# EAGLE design wrist (EAGLE 9.6.2)
COMPANY: ADAFRUIT INDUSTRIES; DRAWN: KTOWN; REV: F
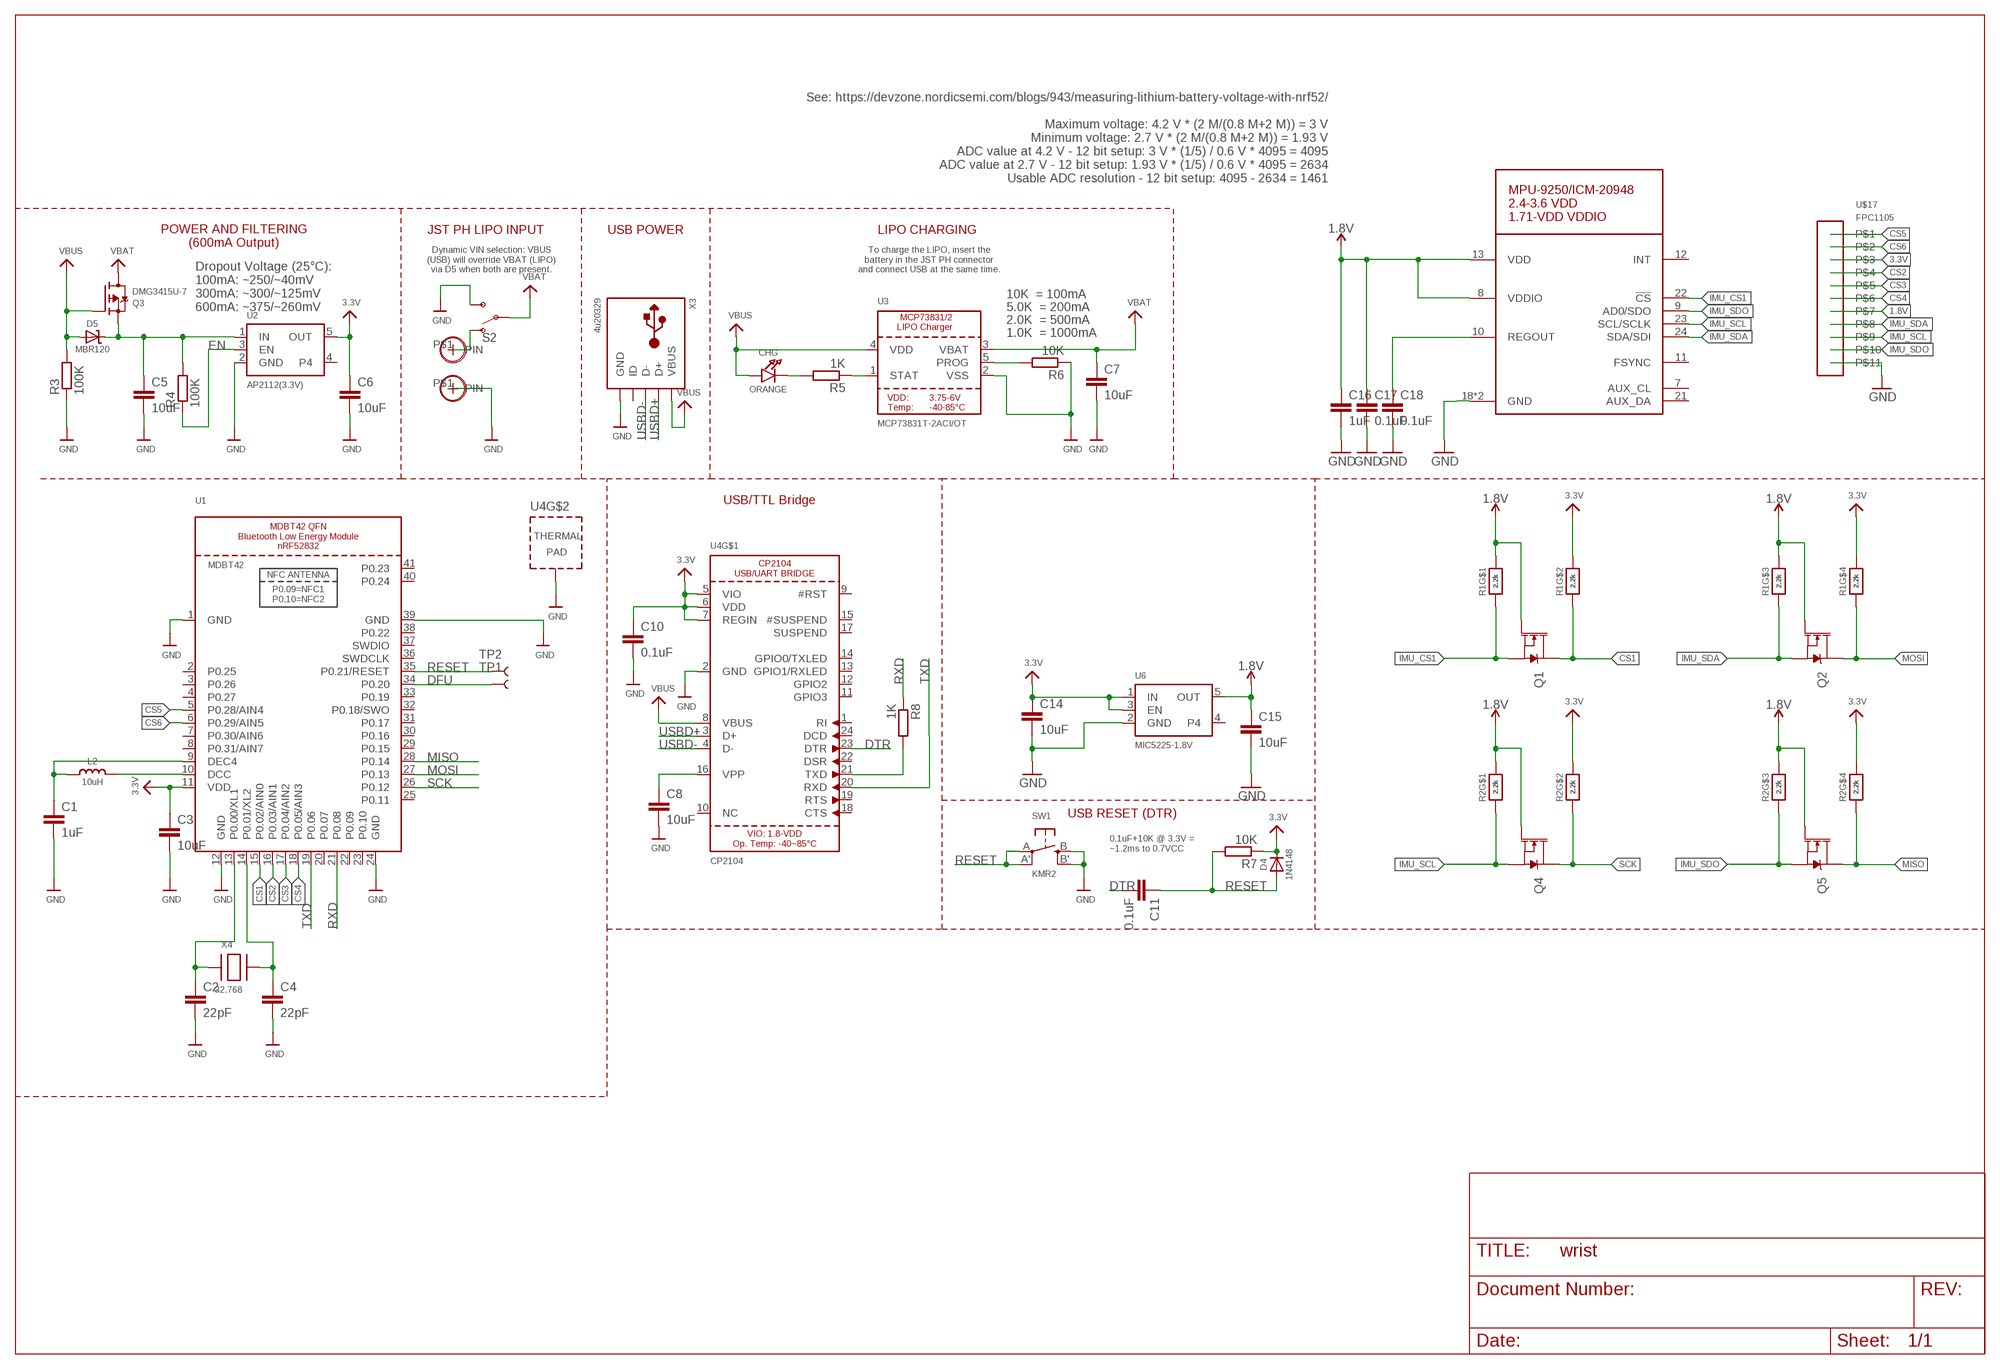
[diagram p0: schematic, sheet 1]

## Parts
C1  1uF  SPARKFUN-CAPACITORS_0.1UF-0402-16V-10%  [SPARKFUN-CAPACITORS_0402]
C2  22pF  SPARKFUN-CAPACITORS_0.1UF-0402-16V-10%  [SPARKFUN-CAPACITORS_0402]
C3  10uF  SPARKFUN-CAPACITORS_0.1UF-0402-16V-10%  [SPARKFUN-CAPACITORS_0402]
C4  22pF  SPARKFUN-CAPACITORS_0.1UF-0402-16V-10%  [SPARKFUN-CAPACITORS_0402]
C5  10uF  SPARKFUN-CAPACITORS_0.1UF-0402-16V-10%  [SPARKFUN-CAPACITORS_0402]
C6  10uF  SPARKFUN-CAPACITORS_0.1UF-0402-16V-10%  [SPARKFUN-CAPACITORS_0402]
C7  10uF  SPARKFUN-CAPACITORS_0.1UF-0402-16V-10%  [SPARKFUN-CAPACITORS_0402]
C8  10uF  SPARKFUN-CAPACITORS_0.1UF-0402-16V-10%  [SPARKFUN-CAPACITORS_0402]
C10  0.1uF  SPARKFUN-CAPACITORS_0.1UF-0402-16V-10%  [SPARKFUN-CAPACITORS_0402]
C11  0.1uF  SPARKFUN-CAPACITORS_0.1UF-0402-16V-10%  [SPARKFUN-CAPACITORS_0402]
C14  10uF  SPARKFUN-CAPACITORS_0.1UF-0402-16V-10%  [SPARKFUN-CAPACITORS_0402]
C15  10uF  SPARKFUN-CAPACITORS_0.1UF-0402-16V-10%  [SPARKFUN-CAPACITORS_0402]
C16  1uF  SPARKFUN-CAPACITORS_0.1UF-0402-16V-10%  [SPARKFUN-CAPACITORS_0402]
C17  0.1uF  SPARKFUN-CAPACITORS_0.1UF-0402-16V-10%  [SPARKFUN-CAPACITORS_0402]
C18  0.1uF  SPARKFUN-CAPACITORS_0.1UF-0402-16V-10%  [SPARKFUN-CAPACITORS_0402]
CHG  ORANGE  LED0805_NOOUTLINE  [CHIPLED_0805_NOOUTLINE]
D4  1N4148  DIODESOD-323  [SOD-323]
D5  MBR120  DIODE-SCHOTTKYSOD-123  [SOD-123]
IC1  ADAFRUIT_SENSOR_MPU-9250_ICM20948  [ADAFRUIT_SENSOR_QFN24_3MM_NOEP]
L2  10uH  INDUCTOR0805-NO  [0805-NO]
Q1  20V/0.2A/8MHz/1.2Ω/1Vth  SPARKFUN-DISCRETESEMI_MOSFET-NCH-RE1C002UN  [SPARKFUN-DISCRETESEMI_SOT-416FL]
Q2  20V/0.2A/8MHz/1.2Ω/1Vth  SPARKFUN-DISCRETESEMI_MOSFET-NCH-RE1C002UN  [SPARKFUN-DISCRETESEMI_SOT-416FL]
Q3  DMG3415U-7  MOSFET-P  [SOT23-R]
Q4  20V/0.2A/8MHz/1.2Ω/1Vth  SPARKFUN-DISCRETESEMI_MOSFET-NCH-RE1C002UN  [SPARKFUN-DISCRETESEMI_SOT-416FL]
Q5  20V/0.2A/8MHz/1.2Ω/1Vth  SPARKFUN-DISCRETESEMI_MOSFET-NCH-RE1C002UN  [SPARKFUN-DISCRETESEMI_SOT-416FL]
R1  2.2k  MICROBUILDER_RESISTOR_4PACK  [MICROBUILDER_RESPACK_4X0603]
R2  2.2k  MICROBUILDER_RESISTOR_4PACK  [MICROBUILDER_RESPACK_4X0603]
R3  100K  R-EU_R0603  [R0603]
R4  100K  R-EU_R0603  [R0603]
R5  1K  R-EU_R0603  [R0603]
R6  10K  R-EU_R0603  [R0603]
R7  10K  R-EU_R0603  [R0603]
R8  1K  R-EU_R0603  [R0603]
S2  SWITCH-SPDT-SMD-RIGHT-ANGLE  [SWITCH_SPST_SMD_A]
SW1  KMR2  SWITCH_TACT_SMT4.6X2.8  [BTN_KMR2_4.6X2.8]
TP1  TEST-POINT3  [PAD.03X.03]
TP2  TEST-POINT3  [PAD.03X.03]
U1  MDBT42  NRF52832_MODULE_MDBT42  [BLE_MODULE_RAYTAC_MDBT42]
U2  AP2112(3.3V)  VREG_SOT23-5  [SOT23-5]
U3  MCP73831T-2ACI/OT  MCP73831/2  [SOT23-5]
U4  CP2104  [QFN24_4MM_SMSC]
U6  MIC5225-1.8V  MICROBUILDER_VREG_SOT23-5  [MICROBUILDER_SOT23-5]
U$17  FPC1105  [FPC1105]
U$23  M3-HOLE_M0.9-HOLE0.9MM  [M3-HOLE_M0.9-HOLE]
U$28  M3-HOLE_M0.9-HOLE0.9MM  [M3-HOLE_M0.9-HOLE]
X3  4u20329  USB_MICRO_20329_V2  [4UCONN_20329_V2]
X4  32.768  XTAL-3.2X1.5  [XTAL3215]

## Nets
1.8V [POWER]: C15.1 C16.1 C17.1 IC1.8(VDDIO) IC1.13(VDD) Q1.1(G) Q2.1(G) Q4.1(G) Q5.1(G) R1.6 R1.8 R2.6 R2.8 U6.5(OUT) U$17.P$7
3.3V [POWER]: C3.1 C6.1 C10.1 C14.1 D4.C R1.5 R1.7 R2.5 R2.7 R7.1 U1.11(VDD) U2.5(OUT) U4.5(VIO) U4.6(VDD) U4.7(REGIN) U6.1(IN) U6.3(EN) U$17.P$3
CS1: Q1.3(D) R1.2 U1.15(P0.02/AIN0)
CS2: U1.16(P0.03/AIN1) U$17.P$4
CS3: U1.17(P0.04/AIN2) U$17.P$5
CS4: U1.18(P0.05/AIN3) U$17.P$6
CS5: U1.5(P0.28/AIN4) U$17.P$1
CS6: U1.6(P0.29/AIN5) U$17.P$2
DFU: TP1.P$1 U1.34(P0.20)
DTR: C11.2 U4.23(DTR)
EN: R4.1 U2.3(EN)
GND: C1.2 C2.2 C3.2 C4.2 C5.2 C6.2 C7.2 C8.2 C10.2 C14.2 C15.2 C16.2 C17.2 C18.2 IC1.18(GND) IC1.20(GND) R3.1 R6.1 S2.3(S) SW1.B'(S1) SW1.B(S) U1.1(GND) U1.12(GND) U1.24(GND) U1.39(GND) U2.2(GND) U3.2(VSS) U4.2(GND) U4.THERM(TP) U6.2(GND) U$17.P$11 U$28.P$1(PIN) X3.BASE@1(GND) X3.BASE@2(GND) X3.GND X3.SPRT@1(GND) X3.SPRT@2(GND) X3.SPRT@3(GND) X3.SPRT@4(GND)
IMU_CS1: IC1.22(!CS) Q1.2(S) R1.1
IMU_SCL: IC1.23(SCL/SCLK) Q4.2(S) R2.1 U$17.P$9
IMU_SDA: IC1.24(SDA/SDI) Q2.2(S) R1.3 U$17.P$8
IMU_SDO: IC1.9(AD0/SDO) Q5.2(S) R2.3 U$17.P$10
MISO: Q5.3(D) R2.4 U1.28(P0.14)
MOSI: Q2.3(D) R1.4 U1.27(P0.13)
N$1: C2.1 U1.13(P0.00/XL1) X4.P$1
N$2: C4.1 U1.14(P0.01/XL2) X4.P$2
N$3: L2.2 U1.10(DCC)
N$4: CHG.C R5.2
N$6: S2.1(O) U$23.P$1(PIN)
N$7: C18.1 IC1.10(REGOUT)
N$8: C1.1 L2.1 U1.9(DEC4)
N$9: R5.1 U3.1(STAT)
N$10: R6.2 U3.5(PROG)
N$11: R8.2 U4.21(TXD)
N$14: C8.1 U4.16(VPP)
RESET: C11.1 D4.A R7.2 SW1.A'(P1) SW1.A(P) TP2.P$1 U1.35(P0.21/RESET)
RXD: R8.1 U1.21(P0.08)
SCK: Q4.3(D) R2.2 U1.26(P0.12)
TXD: U1.19(P0.06) U4.20(RXD)
USBD+: U4.3(D+) X3.D+
USBD-: U4.4(D-) X3.D-
VBAT [POWER]: C7.1 Q3.3(D) S2.2(P) U3.3(VBAT)
VBUS [POWER]: CHG.A D5.A Q3.1(G) R3.2 U3.4(VDD) U4.8(VBUS) X3.VBUS
VIN [POWER]: C5.1 D5.C Q3.2(S) R4.2 U2.1(IN)
Unconnected: IC1.7(AUX_CL) IC1.11(FSYNC) IC1.12(INT) IC1.21(AUX_DA) U1.2(P0.25) U1.3(P0.26) U1.4(P0.27) U1.7(P0.30/AIN6) U1.8(P0.31/AIN7) U1.20(P0.07) U1.22(P0.09) U1.23(P0.10) U1.25(P0.11) U1.29(P0.15) U1.30(P0.16) U1.31(P0.17) U1.32(P0.18/SWO) U1.33(P0.19) U1.36(SWDCLK) U1.37(SWDIO) U1.38(P0.22) U1.40(P0.24) U1.41(P0.23) U2.4 U4.1(RI) U4.9(#RST) U4.10(NC) U4.11(GPIO3) U4.12(GPIO2) U4.13(GPIO1/RXLED) U4.14(GPIO0/TXLED) U4.15(#SUSPEND) U4.17(SUSPEND) U4.18(CTS) U4.19(RTS) U4.22(DSR) U4.24(DCD) U6.4 X3.ID

## Notes on the sheet
- See: https://devzone.nordicsemi.com/blogs/943/measuring-lithium-battery-voltage-with-nrf52/
  
  Maximum voltage: 4.2 V * (2 M/(0.8 M+2 M)) = 3 V
  Minimum voltage: 2.7 V * (2 M/(0.8 M+2 M)) = 1.93 V
  ADC value at 4.2 V - 12 bit setup: 3 V * (1/5) / 0.6 V * 4095 = 4095
  ADC value at 2.7 V - 12 bit setup: 1.93 V * (1/5) / 0.6 V * 4095 = 2634
  Usable ADC resolution - 12 bit setup: 4095 - 2634 = 1461
- JST PH LIPO INPUT | USB POWER | LIPO CHARGING
- POWER AND FILTERING
  (600mA Output)
- Dynamic VIN selection: VBUS
  (USB) will override VBAT (LIPO)
  via D5 when both are present.
- To charge the LIPO, insert the
  battery in the JST PH connector
  and connect USB at the same time.
- 10K  = 100mA
- Dropout Voltage (25°C):
  100mA: ~250/~40mV
  300mA: ~300/~125mV
  600mA: ~375/~260mV
- 5.0K  = 200mA
- 2.0K  = 500mA
- 1.0K  = 1000mA
- USB/TTL Bridge
- USB RESET (DTR)
- 0.1uF+10K @ 3.3V =
  ~1.2ms to 0.7VCC

## Library data of the parts
C1-C8 C14-C16 = SparkFun_IMU_Breakout_ICM-20948:SPARKFUN-CAPACITORS_0.1UF: 0.1µF ceramic capacitors A capacitor is a passive two-terminal electrical component used to store electrical energy temporarily in an electric field.; PROD_ID: CAP-12416; VALUE: 0.1uF
C10 C11 C17 C18 = SparkFun_IMU_Breakout_ICM-20948:SPARKFUN-CAPACITORS_0.1UF: 0.1µF ceramic capacitors A capacitor is a passive two-terminal electrical component used to store electrical energy temporarily in an electric field.; PROD_ID: CAP-12416
CHG = microbuilder:LED: LED 0603 - 0603 Surface Mount Package 2mA: Green LED - Low Power (3.9mcd, 2ma, 1.7Vf) - Digikey: 475-2709-2-ND Orange LED - Low Power (9.8mcd, 2ma, 1.8Vf) - Digikey: 475-1194-2-ND Red LED - Low Power (5mcd, 2ma, 1.8Vf) - Digikey: 475-1195-2-ND Yellow LED - Low Power (7mcd, 2ma, 1.8Vf) - Digikey: 475-1196-2-ND 5mA: Blue LED - Low Power (17mcd, 5ma, 2.9Vf) - Digikey: LNJ937W8CRACT-ND 0805 - 0805 Surface Mount Package 2mA: Red LED (8.8mcd, 2mA, 1.8Vf, Clear) - Low Power [Digikey: 475-2510-1-ND] Green LED (5mcd, 2mA, 1.8Vf, Clear) - Low Power [Digikey: 475-2730-1-ND] Yellow LED (11.3mcd, 2mA, 1.8Vf, Clear) - Low Power [Digikey: 475-2555-1-ND] 20mA: Red LED (104mcd, 20mA, Diffused) - LS R976 [Digikey: 475-1278-6-ND] Red LED (12mcd, 20mA, 2.0Vf, Clear) - APT2012EC [Digikey: 754-1128-1-ND] Green LED (15mcd, 20mA, 2.2Vf, Clear) - APT2012GC [Digikey: 754-1131-1-ND] Orange LED (160mcd, 20mA, 2.1Vf, Clear) - APT2012SECK [Digikey: 754-1130-1-ND] 1206 - 1206 Surface Mount Package Green LED (26mcd, 20mA, Diffused) - LG N971 [Digikey: 475-1407-6-ND] Red LED (15mcd, 20mA, Diffused) - LH N974 [Digikey: 475-1416-6-ND] Cree - Cree High-Power Surface Mount LEDs XPEBWT-L1-0000-00D50 - White 111lm 350mA 2.9Vf 6200K 110° XTEAWT-00-0000-00000LEE3 - White 114lm 350mA 2.85Vf 5000K 115° Everlight - Everlight 45-21 Series Surface Mount LEDs 45-21/QK2C-B2832AC2CB2/2T - Warm White 2000mcd 20mA 3.25Vf 3050K 120° 45-21/LK2C-B38452C4CB2/2T - Nuetral White 2000mcd 20mA 3.25Vf 4150K 120° 45-21/LK2C-B50634C6CB2/2T - Cold White 2200mcd 20mA 3.25Vf 5650K 120° PLCC2 Reverse Mount LS T77K-J1L2-1-0-2-R18-Z - Red 11.25mcd 2mA 1.8Vf 630nm 120° LO T77K-L1M2-24-Z - Orange 19.6mcd 2mA 1.8Vf 606nm 120° LY T77K-K2M1-26-Z - Yellow 15.7mcd 2mA 1.8Vf 587nm 120°
D4 = microbuilder:DIODE: Diode SMA Model Volts Amps Type Vf Ir Digikey # Notes SSA34-E3 40V 3A Schottky 480mV @ 3A 200uA @ 40V SSA34-E3/61TGITR-ND CDBA120-G 20V 1A Schottky 500mV @ 1A 500uA @ 20V 641-1014-6-ND REEL MBRA210 10V 2A Schottky 350mV @ 2A 700uA @ 10V MBRA210LT3 SOD-123 Model Volts Amps Type Vf Ir Order # Notes BAT54T1G 30V 200mA Schottky 800mV @ 200mA 2uA @ 25V BAT54T1GOSTR-ND B0530W 30V 500mA Schottky 430mV @ 500mA 130uA @ 30V B0530W-FDICT-ND REEL MBR120 20V 1A Schottky 340mV @ 1A MBR120VLSFT1GOSCT-ND SOD-323 Model Volts Amps Type Vf Ir Order # Notes PMEG2005EJ 20V 500mA Schottky 355mV @ 500mA 568-4110-1-ND ZLLS410 10V 570mA Schottky 380mV @ 570mA ZLLS410CT-ND 1N4148WS 75V 150mA Silicon/Simple 1V 1N4148WSFSCT-ND REEL SOD-523 Model Volts Amps Type Vf Ir Order # Notes BAT54XV2 30V 200mA Schottky 0.8V @ 100mA BAT54XV2CT-ND TB751S 30V 30mA Schottky RB751S-40TE61CT-ND SOT23-R/W (R = Solder Paste/Reflow Ovens, W = Hand-Soldering) Model Volts Amps Type Vf Ir Order # Notes BAT54FILM 40V 300mA Schottky 497-7162-1-ND POWERDI-5 Model Volts Amps Type Vf Ir Order # Notes PDS560 60V 5A Schottky 670mV @ 5A 150uA @ 60V PDS560DICT-ND
D5 = microbuilder:DIODE-SCHOTTKY
IC1 = Adafruit ICM20948:ADAFRUIT_SENSOR_MPU-9250: MPU-9250 3-Axis gyroscope and 3-Axis accelerometer
L2 = microbuilder:INDUCTOR: Inductors 0603: 10nH Ceramic Inductor - microwire antenna/RF (Digikey: 712-1434-2-ND) 0805: 560nH Ceramic Inductor - RF (Digikey: 553-1047-1-ND) 270nH Ceramic Inductor - Q = 40@250MHz, +-5%, 1 Ohm DC Resistance (Digikey: 535-10506-2-ND) 1007 (2518 Metric) SMT: 10µH 10% 250mOhm 820mA 1007 Inductor (Digikey: 587-2189-1-ND) 22µH 10% 500mOhm 580mA 1007 Inductor (Digikey: 587-2190-1-ND) 47µH 10% 950mOhm 420mA 1007 Inductor (Digikey: 587-2191-1-ND) 47µH 5% 100mOhm 1A 1008 Inductor (Digikey: 732-1816-1-ND) 5.0x5.0mm (Taiyo Yuden NR5040 Series) 6.8µH 20% 2.3A 64mOhm Inductor (Digikey: 587-2374-2-ND) 5.0x5.0mm (TDK VLC5045 Series) 4.7µH 20% 3.3A 34mOhm Inductor (Digikey: 445-6526-1-ND) 6.8µH 20% 2.7A 46mOhm Inductor (Digikey: 445-6527-1-ND) 6.0x6.0mm (TDK VLC6045 Series) 4.7µH 20% 3.8A 27mOhm Inductor (Digikey: 445-6538-2-ND) 6.8µH 20% 3A 41mOhm Inductor (Digikey: 445-6540-1-ND) 6.2µH 30% 2.2A 45mOhm Inductor (Digikey: SRR5028-6R2YCT-ND) - Not TDK VLC6045 but footprint should match 6.0x6.0mm (TDK SLF6045 Series) 6.8uH 30% 2A 33mOhm Inductor (Digikey: 445-4572-1-ND, Mouser: 810-SLF645T6R8N2R0PF) 6.0x6.0mm (Sumida CDRH5D28 Series) 6.2uH 30% 1.8A 45mOhm Inductor (Digikey: 308-1542-1-ND) Taiyo Yuden NR3015T2R2M - 2.2uH 20% 1.5A (Digikey: 587-1648-2-ND, Mouser: 963-NR3015T2R2M) - Used with TI TPS62172 CoilCraft RFID Transponder Coil - MA5532-AE (For use with AS3935 Lightning Sensor) Taiyo Yuden NRH2412T2R2MNGH - 2.2uH 20% 1AA (Digikey: 587-3443-1-ND) - Used with TI LM3671 Vishay IHLP 1.0uH Molded Inductor - 24mOhm DCR, 5A, +/-20%, -55°C-125°C (Digikey: 541-1319-1-ND)
Q1 Q2 Q4 Q5 = SparkFun_IMU_Breakout_ICM-20948:SPARKFUN-DISCRETESEMI_MOSFET-NCH: N-channel MOSFETs Voltage controlled devices that allow control of high current outputs. SparkFun Products: SparkFun OpenScale <https://www.sparkfun.com/products/13261> SparkFun Digital Sandbox <https://www.sparkfun.com/products/12651> SparkFun Monster Moto Shield <https://www.sparkfun.com/products/10182> SparkFun MOSFET Power Controller <https://www.sparkfun.com/products/11214>; PROD_ID: TRANS_14399
Q3 = microbuilder:MOSFET-P: P-Channel Mosfet LEGEND VDS: Voltage Drain-Source ID: Drain Current RDS(ON): Drain-Source On-State Resistance VGS(TH): Gate-Source Threshold Voltage CISS: Drain-Source Input Capacitance SOT-23 Name VDS ID RDS(ON) VGS(TH) CISS Order Number IRLML5103 30V 760mA 600 mOhm -- 75pF @ 25V Digikey: IRLML5103PBFCT-ND IRLML6401 12V 4.3A 50 mOhm 950mV @ 250µA 830pF @ 10V Digikey: IRLML6401PBFTR-ND NTR0202PL 20V 400mA 800 mOhm 2.3V @ 250uA 70pF @ 5V Digikey: NTR0202PLT1GOSTR-ND NTR4101PT1G 20V 1.8A 85 mOhm 1.2V @ 250uA 675pF @ 10V Digikey: NTR4101PT1GOSCT-ND DMP2004K 20V 600mA 900 mOhm 1V @ 250uA 175pF @ 16V Digikey: DMP2004KDICT-ND PMV65XP 20V 3.9A 76 mOhm 950mV @ 1mA 725pF @ 20V Digikey: 568-2358-2-ND TO-252 Name VDS ID RDS(ON) VGS(TH) CISS Order Number AOD417 30V 25A 34 mOhm 3V @ 250µA 920pF @ 15V Digikey: 785-1106-2-ND
R1 R2 = Adafruit ICM20948:MICROBUILDER_RESISTOR_4PACK: Resistor Packs (4 resistors) 4 x 0603 10K 1/16W - Digikey: YC164J-10KCT-ND
R3-R8 = rcl:R-EU_: RESISTOR, European symbol; SPICEPREFIX: R
S2 = SparkFun-Switches:SWITCH-SPDT: Single Pole, Double Throw (SPDT) Switch Single-pole, double-throw (SPDT) switch. Variant Overview SMD-AYZ0202 Surface Mount DPDT Switch <https://www.sparkfun.com/products/597> (COM-00597) Used on e.g. LilyPad Arduino USB - ATmega32U4 Board <https://www.sparkfun.com/products/12049> PTH-11.6X4.0MM SPDT Mini Power Switch <https://www.sparkfun.com/products/102> (COM-00102) Used on e.g. SparkFun Simon Says - Through-Hole Soldering Kit <https://www.sparkfun.com/products/10547> (KIT-10547) PTH-11.6X4.0MM-KIT KIT version of SPDT Mini Power Switch - Simplifies soldering by removing tStop of switch pins - only one side can be soldered. PTH-11.6X4.0MM-LOCK LOCK version of SPDT Mini Power Switch - Offset pins hold switch in place for easier soldering. SMD-RIGHT-ANGLE Surface Mount Right Angle Switch <https://www.sparkfun.com/products/10860> (COM-10860) Used on e.g. SparkFun ESP8266 Thing <https://www.sparkfun.com/products/13231>; PROD_ID: SWCH-10651; SF_SKU: COM-10860
SW1 = microbuilder:SWITCH_TACT_SMT: SMT Tact Switches 6x6mm - Digikey: P12940SCT-ND KMR2 (4.6x2.8mm) - Digikey: 401-1426-1-ND EVQ-PQHB55 - Light Touch, 160GF (4.5x4.5mm) - Digikey: P8090SCT-ND KMT0 - KMT021 NGJ LHS (etc.) IP68/Waterproof - Digikey: CKN10289CT-ND
TP1 TP2 = SparkFun-Connectors:TEST-POINT: SparkFun Test Points Bare copper test points for troubleshooting or In-Circuit-Testing. These are used by our Production team for verifying production board runs using pogo-pins on test beds. SparkFun Products: SparkFun LSM9DS1 Breakout <https://www.sparkfun.com/products/13284> SparkFun PSOC <https://www.sparkfun.com/products/13714> SparkFun Load Cell Amplifier <https://www.sparkfun.com/products/13879>
U1 = microbuilder:NRF52832_MODULE_MDBT42: MDBT42 - BLE Module (nRF52832 QFN) VDD: 1.7-3.6V
U2 = microbuilder:VREG_SOT23-5: SOT23-5 Fixed Voltage Regulators Part Current Out V Out V In V Dropout θJA (°C/W) TJ (°C) Digikey Part No. ADP121 150mA 3.3V 3.4-5.5V 0.09V @ 150mA -- -- ADP121-AUJZ33R7CT-ND ADP121 150mA 3.0V 3.1-5.5V 0.09V @ 150mA -- -- ADP121-AUJZ30R7CT-ND ADP122 300mA 3.3V 3.4-5.5V 0.085V @ 300mA -- -- ADP122AUJZ-3.3-R7CT-ND ADP1712 300mA 3.3V 3.5-5.5V 0.17V @ 300mA -- -- ADP1712AUJZ-3.3-R7TR-ND AP7311 (Low Cost) 150mA 3.3V 3.5-6V 0.15V @ 150mA -- -- AP7311-33WG-7DICT-ND LD39015M18R 150mA 1.8V 1.9V-5.5V 0.08V @ 100mA -- -- 497-6977-1-ND LP2985A-33DBVR 150mA 3.3V 3.3-16V 0.28V @ 150mA 206 150 296-18479-1-ND MCP1824T-3302E/OT 300mA 3.3V 3.5V-6V 0.2V @ 300mA -- -- MCP1824T-3302E/OTCT-ND MIC5205-2.5YM5 TR 150mA 2.5V 2.7-16V 0.165V @ 150mA -- -- 576-1257-2-ND MIC5205-3.0YM5 TR 150mA 3.0V 3.2V-16V 0.165V @ 150mA -- -- 576-1258-2-ND MIC5205-3.3YM5 TR 150mA 3.3V 3.5V-16V 0.165V @ 150mA -- -- 576-1259-2-ND TPS780330220 150mA 3.3V+2.2V 3.6-5.5V 250mV Max -- -- 296-23332-1-ND TDA3663/N1,135 100mA 3.3V 3.5-45V 0.18V @ 50mA -- -- 568-5343-1-ND Max operating temp can be calculated using θJA, TJ (max junction temperature), and power in watts. Set the "Maximum Ambient Temperature" until it reaches TJ ("Max Junction Temperature"), which is the absolute limit for safe use of the regulator: Heat Sink Temperature Calculator <http://www.daycounter.com/Calculators/Heat-Sink-Temperature-Calculator.phtml> For example, With 12V source into a 3.3V LP2985 and a 30mA load, we are dissipating (12V-3.3V) * 0.03A = 0.261W. With a θJA of 206 °C/W, a TJ of 150°C, and 261mW we can safely use the chip without a heat sink up to 75°C (=147.1°C Junction Temperature).
U3 = microbuilder:MCP73831/2: MCP73831/2 LIPO Charger VDD: 3.75 - 6V Temp -40 - 85°C Programmable Charge Rate: 15-500mA NOTE: STAT is a tri-state logic output on the MCP73831 and an open-drain output on the MCP73832. SOT23-5 with 4.2V output and tri-state logic on STAT = MCP73831T-2ACI/OT
U4 = microbuilder:CP2104: CP2104 - USB to UART Bridge VDD Output: 3.45V
U6 = Adafruit ICM20948:MICROBUILDER_VREG_SOT23-5: SOT23-5 Fixed Voltage Regulators Part Current Out V Out V In V Dropout θJA (°C/W) TJ (°C) Digikey Part No. ADP121 150mA 3.3V 3.4-5.5V 0.09V @ 150mA -- -- ADP121-AUJZ33R7CT-ND ADP121 150mA 3.0V 3.1-5.5V 0.09V @ 150mA -- -- ADP121-AUJZ30R7CT-ND ADP122 300mA 3.3V 3.4-5.5V 0.085V @ 300mA -- -- ADP122AUJZ-3.3-R7CT-ND ADP1712 300mA 3.3V 3.5-5.5V 0.17V @ 300mA -- -- ADP1712AUJZ-3.3-R7TR-ND AP7311 (Low Cost) 150mA 3.3V 3.5-6V 0.15V @ 150mA -- -- AP7311-33WG-7DICT-ND LD39015M18R 150mA 1.8V 1.9V-5.5V 0.08V @ 100mA -- -- 497-6977-1-ND LP2985A-33DBVR 150mA 3.3V 3.3-16V 0.28V @ 150mA 206 150 296-18479-1-ND MCP1824T-3302E/OT 300mA 3.3V 3.5V-6V 0.2V @ 300mA -- -- MCP1824T-3302E/OTCT-ND MIC5205-2.5YM5 TR 150mA 2.5V 2.7-16V 0.165V @ 150mA -- -- 576-1257-2-ND MIC5205-3.0YM5 TR 150mA 3.0V 3.2V-16V 0.165V @ 150mA -- -- 576-1258-2-ND MIC5205-3.3YM5 TR 150mA 3.3V 3.5V-16V 0.165V @ 150mA -- -- 576-1259-2-ND TPS780330220 150mA 3.3V+2.2V 3.6-5.5V 250mV Max -- -- 296-23332-1-ND TDA3663/N1,135 100mA 3.3V 3.5-45V 0.18V @ 50mA -- -- 568-5343-1-ND Max operating temp can be calculated using θJA, TJ (max junction temperature), and power in watts. Set the "Maximum Ambient Temperature" until it reaches TJ ("Max Junction Temperature"), which is the absolute limit for safe use of the regulator: Heat Sink Temperature Calculator <http://www.daycounter.com/Calculators/Heat-Sink-Temperature-Calculator.phtml> For example, With 12V source into a 3.3V LP2985 and a 30mA load, we are dissipating (12V-3.3V) * 0.03A = 0.261W. With a θJA of 206 °C/W, a TJ of 150°C, and 261mW we can safely use the chip without a heat sink up to 75°C (=147.1°C Junction Temperature).
U$17 = my_library:FPC1105
U$23 U$28 = 3M_Hole:M3-HOLE_M0.9-HOLE
X3 = microbuilder:USB: USB Connectors USBMINIB - Surface Mount Female Mini-B USB Connector 4UConnector: 06564
X4 = adafruit2:XTAL: Low cost SMT crystals, no capacitors included http://www.ladyada.net/library/eagle

## Net classes
0 default: width 0.203 mm
1 POWER: width 0.305 mm

## Board
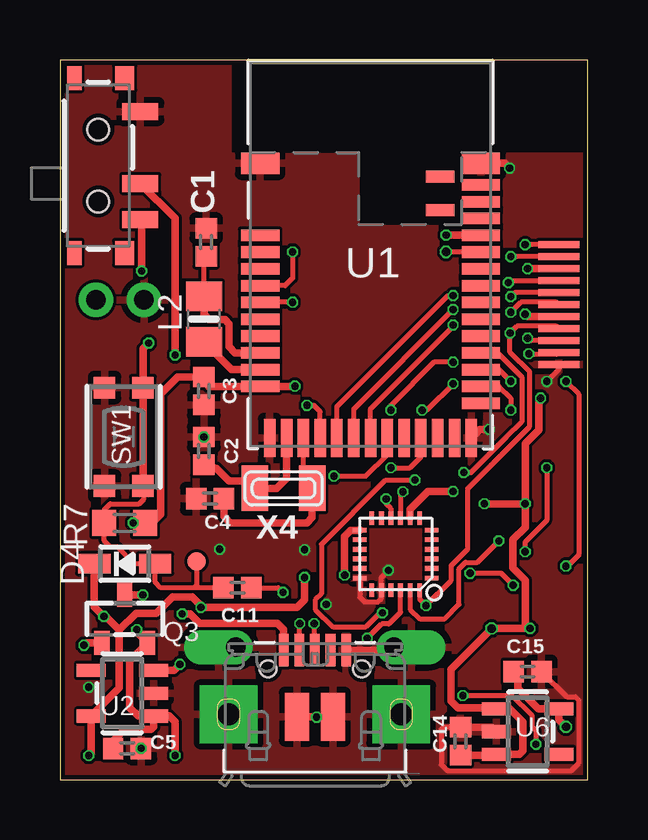
[diagram p1: board, top side]
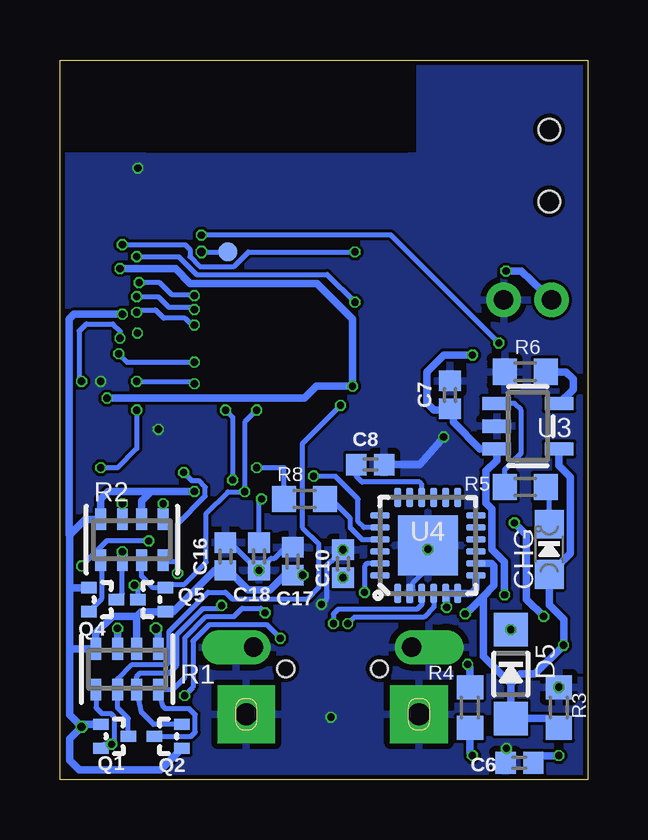
[diagram p2: board, bottom side, seen from below]

Size 22 x 30 mm. Coordinates in mm from the lower left corner, seen from the top.
Outline: 0,0 22,0 22,30 0,30 0,0
Copper layers (1*16): Top 0.035mm / dielectric 1.6mm / Bottom 0.035mm
Design rules "jlcpcb-2layers *": minimum track width 5mil, minimum drill 0.3mm, track to track 5mil, track to pad 5mil, pad to pad 5mil, via to via 5mil, smd to smd 5mil, copper to edge 0.2mm, drill to drill 6mil, minimum pad ring 10mil, minimum via ring 3mil, stop-mask expansion 4mil, vias tented up to drill 20mil, thermal gap 10mil

### Footprints (pad centres in the part's own frame; a part is rotated, then mirrored left to right if it is on the bottom)
SPARKFUN-CAPACITORS_0402 = smd 0.85 x 0.9: 1 -0.58,0; 2 0.58,0
CHIPLED_0805_NOOUTLINE = smd 1.2 x 1.2: A 0,-1.05; C 0,1.05
SOD-323 = smd 1.35 x 0.8: A 1.27,0; C -1.27,0
SOD-123 = smd 1.4 x 1.4: A 1.85,0; C -1.85,0
ADAFRUIT_SENSOR_QFN24_3MM_NOEP = smd 0.55 x 0.2: 1 -1.5,1; 2 -1.5,0.6; 3 -1.5,0.2; 4 -1.5,-0.2; 5 -1.5,-0.6; 6 -1.5,-1; 13 1.5,-1; 14 1.5,-0.6; 15 1.5,-0.2; 16 1.5,0.2; 17 1.5,0.6; 18 1.5,1 | smd 0.2 x 0.55: 7 -1,-1.5; 8 -0.6,-1.5; 9 -0.2,-1.5; 10 0.2,-1.5; 11 0.6,-1.5; 12 1,-1.5; 19 1,1.5; 20 0.6,1.5; 21 0.2,1.5; 22 -0.2,1.5; 23 -0.6,1.5; 24 -1,1.5
0805-NO = smd 1.24 x 1.5: 1 -0.95,0; 2 0.95,0
SPARKFUN-DISCRETESEMI_SOT-416FL = smd 0.46 x 0.65: 1 -0.5,-1.1; 2 0.5,-1.1; 3 0,0.05
SOT23-R = smd 0.635 x 1.016: 1 -0.95,-1; 2 0.95,-1; 3 0,1
MICROBUILDER_RESPACK_4X0603 = smd 0.45 x 0.9: 1 -1.3,-0.85; 2 -0.4,-0.85; 3 0.4,-0.85; 4 1.3,-0.85; 5 1.3,0.85; 6 0.4,0.85; 7 -0.4,0.85; 8 -1.3,0.85
R0603 = smd 1 x 1.1: 1 -0.85,0; 2 0.85,0
SWITCH_SPST_SMD_A = smd 0.7 x 1.5: 1 -2.25,-1.75; 2 -0.75,-1.75; 3 2.25,-1.75 | smd 1 x 0.6: GND1 -3.65,1; GND3 3.65,1 | smd 1 x 0.8: GND2 -3.65,-1.1; GND4 3.65,-1.1 | hole 0.9: -1.5,0; 1.5,0
BTN_KMR2_4.6X2.8 = smd 0.9 x 0.9: A 2.05,0.8; A' -2.05,0.8; B 2.05,-0.8; B' -2.05,-0.8
PAD.03X.03 = smd 0.762 x 0.762: P$1 0,0
BLE_MODULE_RAYTAC_MDBT42 = smd 1.6 x 0.9: 1 -4.6,3.8; 39 4.6,3.8 | smd 1.6 x 0.48: 2 -4.6,0.8; 3 -4.6,0.1; 4 -4.6,-0.6; 5 -4.6,-1.3; 6 -4.6,-2; 7 -4.6,-2.7; 8 -4.6,-3.4; 9 -4.6,-4.1; 10 -4.6,-4.8; 11 -4.6,-5.5; 25 4.6,-6.2; 26 4.6,-5.5; 27 4.6,-4.8; 28 4.6,-4.1; 29 4.6,-3.4; 30 4.6,-2.7; 31 4.6,-2; 32 4.6,-1.3; 33 4.6,-0.6; 34 4.6,0.1; 35 4.6,0.8; 36 4.6,1.5; 37 4.6,2.2; 38 4.6,2.9 | smd 0.48 x 1.6: 12 -4.2,-7.65; 13 -3.5,-7.65; 14 -2.8,-7.65; 15 -2.1,-7.65; 16 -1.4,-7.65; 17 -0.7,-7.65; 18 0,-7.65; 19 0.7,-7.65; 20 1.4,-7.65; 21 2.1,-7.65; 22 2.8,-7.65; 23 3.5,-7.65; 24 4.2,-7.65 | smd 1.2 x 0.5: 40 2.9,3.25; 41 2.9,1.85
SOT23-5 = smd 0.55 x 1.2: 1 -0.95,-1.3; 2 0,-1.3; 3 0.95,-1.3; 4 0.95,1.3; 5 -0.95,1.3
QFN24_4MM_SMSC = smd 0.8 x 0.28: 1 -2,1.25; 2 -2,0.75; 3 -2,0.25; 4 -2,-0.25; 5 -2,-0.75; 6 -2,-1.25; 13 2,-1.25; 14 2,-0.75; 15 2,-0.25; 16 2,0.25; 17 2,0.75; 18 2,1.25 | smd 0.28 x 0.8: 7 -1.25,-2; 8 -0.75,-2; 9 -0.25,-2; 10 0.25,-2; 11 0.75,-2; 12 1.25,-2; 19 1.25,2; 20 0.75,2; 21 0.25,2; 22 -0.25,2; 23 -0.75,2; 24 -1.25,2 | smd 2.5 x 2.5: THERM 0,0
MICROBUILDER_SOT23-5 = smd 0.55 x 1.2: 1 -0.95,-1.3; 2 0,-1.3; 3 0.95,-1.3; 4 0.95,1.3; 5 -0.95,1.3
FPC1105 = smd 0.3 x 1.7: P$1 -2,0; P$2 -1.5,0; P$3 -1,0; P$4 -0.5,0; P$5 0,0; P$6 0.5,0; P$7 1,0; P$8 1.5,0; P$9 2,0; P$10 2.5,0; P$11 3,0
M3-HOLE_M0.9-HOLE = drill 0.8 pad 0.55: P$1 0,0
4UCONN_20329_V2 = smd 1 x 2: BASE@1 -0.75,-2; BASE@2 0.75,-2 | smd 0.4 x 1.35: D+ 0,0.775; D- -0.65,0.775; GND 1.3,0.775; ID 0.65,0.775; VBUS -1.3,0.775 | drill 0.8 pad 1.143 offset: SPRT@1 -3.3,0.9; SPRT@2 3.3,0.9 | drill 0.9 pad 2.413 square: SPRT@3 -3.6,-1.9; SPRT@4 3.6,-1.9 | hole 0.7: -1.95,0; 1.95,0
XTAL3215 = smd 1.1 x 1.9: P$1 1.2,0; P$2 -1.2,0

### Placement (x,y rotation side)
C1  6.1,22.4 90 top
C2  6,13.7 90 top
C3  6,16.2 270 top
C4  6.26,11.71 180 top
C5  2.8,1.3 0 top
C6  2.84,0.7 180 bottom
C7  5.74,16.04 90 bottom
C8  9.06,13.13 0 bottom
C10  10.2,9 90 bottom
C11  7.4,8 0 top
C14  16.7,1.6 90 top
C15  19.5,4.5 0 top
C16  15.1,9.3 90 bottom
C17  12.3,9.1 90 bottom
C18  13.7,9.3 270 bottom
CHG  1.6,9.6 0 bottom
D4  2.7,9 0 top
D5  3.2,4.4 270 bottom
IC1  14,9.4 180 top
L2  6,19.2 270 top
Q1  19.2,1.8 270 bottom
Q2  18.01,1.8 90 bottom
Q3  2.7,6.7 0 top
Q4  19.7,7.5 270 bottom
Q5  18.7,7.5 90 bottom
R1  19.2,4.6 0 bottom
R2  19,10 0 bottom
R3  1.2,3 270 bottom
R4  4.9,3 270 bottom
R5  2.6,12.2 0 bottom
R6  2.6,17 0 bottom
R7  2.7,10.7 180 top
R8  11.8,11.7 0 bottom
S2  1.6,25.6 90 top
SW1  2.66,14.29 270 top
TP1  15,22 0 bottom
TP2  5.7,9.1 0 top
U1  12.95,21.89 0 top
U2  2.6,3.6 90 top
U3  2.49,14.73 270 bottom
U4  6.66,9.76 90 bottom
U6  19.5,2 270 top
U$17  20.8,20.3 270 top
U$23  1.5,20 0 top
U$28  3.5,20 0 top
X3  10.63,4.62 0 top
X4  9.32,12.14 180 top

### Tracks (layer width: path | path; a pad name or v marks a point on that pad's centre or on a via)
1.8V  (via drill 0.3 pad 0.2, 0.35 pad 0.2)
  Top 0.305: v21.1,2.2 20.8,2.5 U6.5 19.95,2.95 19.1,3.8 19.1,4.32 C15.1 | IC1.8 14.6,11.27 15.34,12.01 v16.39,12.01 | IC1.13 12.48,10.38 12.11,10.38 11.87,10.14 v11.87,8.52 | U$17.P$7 19.5,19.3 v19.4,19.4
  Bottom 0.305: Q1.1 21,2.3 v21.1,2.2 | Q2.1 17.81,0.4 21.2,0.4 21.6,0.8 21.6,1.7 v21.1,2.2 | 21.6,8 21.6,5.4 | 21.6,5.4 21.6,2.7 v21.1,2.2 | 21.6,8 21.6,10.2 | 21.6,10.2 20.95,10.85 R2.8 20.3,11.7 19.99,12.01 18.2,12.01 | 21.6,10.2 21.61,10.19 21.61,19.19 21.4,19.4 v19.4,19.4 | v16.39,12.01 18.2,12.01 | R1.6 18.8,6.8 | 18.8,6.8 18.61,6.99 18.11,6.99 18.1,7 Q5.1 17.27,7 15.55,8.72 C16.1 14.97,8.72 14.17,7.92 13.23,7.92 12.63,8.52 C17.1 v11.87,8.52 | 18.8,6.8 19.39,6.8 19.39,6.81 19.81,6.81 20.51,6.11 R1.8 21.55,5.45 21.6,5.4 | Q4.1 21.6,8 | 18.2,12.01 18.6,11.61 R2.6
3.3V  (via drill 0.3 pad 0.2, 0.35 pad 0.2)
  Top 0.305: C14.1 18.17,1.02 U6.3 19.15,1.05 19.3,1.2 19.3,2.4 18.75,2.95 U6.1 18.16,2.99 16.59,2.99 16.29,3.29 16.29,4.59 v18,6.3 v19.6,6.3 19.41,6.49 19.41,8.31 18.89,8.82 18.89,10.01 19.4,10.52 v19.4,11.5 | v17.7,11.5 v19.4,11.5 | C10.1 10.2,7.5 9.88,7.18 v5.88,7.18 5.91,7.21 5.51,7.61 4.7,7.61 4.02,6.93 3.17,6.93 2.47,6.23 | v1.2,1 1.3,1.1 U2.5 2.47,3.82 2.47,6.23 | D4.C 1.43,7.2 v1.83,6.8 1.9,6.8 2.47,6.23 | v19.5,21.3 U$17.P$3 | v9.8,16.4 v9.79,16.39 U1.11 6.19,16.39 C3.1 4.9,16.78 4.2,16.08 4.2,11.05 3.85,10.7 R7.1 v3.05,10.7 | v19.4,11.5 19.4,14 19.97,14.57 19.97,15.83 v20.04,15.9
  Bottom 0.305: R1.7 v19.6,6.3 | R2.7 v19.4,11.5 | R2.5 v17.7,11.5 | R1.5 17.9,6.2 v18,6.3 | v1.2,1 2.11,1 C6.1 | U4.7 4.66,7.94 4.84,7.76 U4.6 U4.5 5.88,7.73 v5.88,7.18 | v1.83,6.8 2.55,7.52 2.55,10.2 v3.05,10.7 | v19.5,21.3 19.02,21.3 19.01,21.29 17.18,21.29 16.56,20.68 11.28,20.68 9.8,19.2 v9.8,16.4 v9.81,16.41 11.31,16.41 11.81,15.91 19.21,15.91 19.21,15.9 v20.04,15.9
  other vias: 10.2,8.42
CS1  (via drill 0.3 pad 0.2)
  Top 0.203: U1.15 10.85,15.34 10.59,15.6 v10.3,15.6
  Bottom 0.203: Q1.3 19.15,2.55 19.6,3 R1.2 19.6,4.2 19.03,4.77 17.58,4.77 17.45,4.91 17.45,6.19 15.82,7.81 15.1,7.81 14.82,7.54 11.69,7.54 11.22,8.01 11.22,9.84 11.9,10.52 11.9,14 v10.3,15.6
CS2  (via drill 0.3 pad 0.2)
  Top 0.203: U1.16 11.55,15.55 16.17,20.17 v16.4,20.17 | v18.7,20.71 18.79,20.8 U$17.P$4
  Bottom 0.203: v16.4,20.17 16.42,20.2 17.32,20.2 17.84,20.71 v18.7,20.71
CS3  (via drill 0.3 pad 0.2)
  Top 0.203: U1.17 12.25,15.45 v16.39,19.59 v16.4,19.59 | v18.8,20.13 18.97,20.3 U$17.P$5
  Bottom 0.203: v18.8,20.13 17.9,20.13 17.46,19.69 16.5,19.69 v16.4,19.59
CS4  (via drill 0.3 pad 0.2)
  Top 0.203: U1.18 12.95,15.45 16.4,18.9 v16.4,18.95 | v18.8,19.48 19.22,19.9 20.7,19.9 U$17.P$6
  Bottom 0.203: v16.4,18.95 16.5,18.95 16.78,19.24 17.67,19.24 18.01,19.58 18.7,19.58 v18.8,19.48
CS5  (via drill 0.3 pad 0.2)
  Top 0.203: U$17.P$1 v19.4,22.3 | v9.7,22 9.7,20.9 9.39,20.59 U1.5
  Bottom 0.203: v19.4,22.3 16.78,22.3 16.58,22.1 16.58,21.8 16.17,21.39 14.75,21.39 14.14,22 v9.7,22
CS6  (via drill 0.3 pad 0.2)
  Top 0.203: U$17.P$2 v18.8,21.8 | v9.7,19.9 U1.6
  Bottom 0.203: v18.8,21.8 17.05,21.8 16.31,21.06 10.86,21.06 v9.7,19.9
DFU  (via drill 0.35 pad 0.2)
  Top 0.203: U1.34 v16.11,21.99 v16.1,22
  Bottom 0.203: v16.1,22 TP1.P$1
DTR  (via drill 0.3 pad 0.2)
  Top 0.203: C11.2 9.1,8 v9.3,7.8
  Bottom 0.203: U4.23 9.19,9.01 9.3,8.9 v9.3,7.8
EN  (via drill 0.3 pad 0.2)
  Top 0.305: v5,4.8 4.75,4.55 U2.3
  Bottom 0.305: R4.1 4.9,4.7 v5,4.8
GND  (via drill 0.3 pad 0.2)
  Top 0.203: IC1.18 12.5,7.6 12.7,7.4 13.24,7.4 13.4,7.55 IC1.20 13.4,8.42 C18.2 | U$17.P$11 20.8,17.1 v20.3,16.6 | C15.2 21.13,3.45 21.5,3.45 21.63,3.32 21.63,0.68 21.32,0.37 16.16,0.37 15.9,0.62 15.9,2.1 15.98,2.18 C14.2
  Top 0.305: C14.2 18.02,2.18 U6.2 | X3.BASE@1 10.68,2.62 v10.7,2.6 | X3.GND 12.59,5.39 12.6,5.38 13.79,5.38 X3.SPRT@2 | U1.39 18.55,25.69 v18.75,25.49 | U1.24 17.51,14.6 v17.9,14.6
  Bottom 0.203: C16.2 14.9,9.88 13.74,8.72 C18.2 13.19,9.23 13.05,9.23 12.6,9.68 C17.2 | U4.2 7.28,7.89 7.28,8.21 6.66,8.83 v6.66,9.6 U4.THERM | C10.2 10.71,9.07 10.74,9.07 10.89,8.93 10.89,7.51 v11.1,7.3
  Bottom 0.305: C8.2 6.99,13.13 C2.2 | C6.2 3.46,0.74 C5.2
  other vias: 13.7,8.72 6,14.28 1.2,3.85 3.38,1.3 10.2,9.58
  pour Top: 0,30 7,30 7,26 22,26 22,0 0,0
  pour Bottom: 0,30 7,30 7,26 22,26 22,0 0,0
IMU_CS1  (via drill 0.3 pad 0.2)
  Top 0.203: v12.81,5.89 13.41,6.49 13.71,6.49 14.2,6.98 IC1.22 | v19.85,1.47 19.85,2.05 19.68,2.22 19.68,2.67 18.85,3.5 v16.8,3.5
  Bottom 0.203: v16.8,3.5 16.46,3.84 16.46,5.78 15.76,6.47 13.39,6.47 v12.81,5.89 | R1.1 20.5,3 20.26,2.76 19.88,2.76 19.75,2.62 19.75,1.57 v19.85,1.47 20.13,1.47 Q1.2
IMU_SCL  (via drill 0.3 pad 0.2)
  Top 0.203: IC1.23 14.6,7.1 15,6.7 16.05,6.7 16.64,7.29 16.64,8.79 16.91,9.05 17.4,9.05 v18.3,9.95 | v21.09,8.9 21.17,8.9 21.66,9.39 21.66,16.05 v21.1,16.6 | U$17.P$9 19.6,18.3 v19.5,18.4
  Bottom 0.203: 20.3,9.7 R2.1 20.25,9.1 20.25,7.55 Q4.2 | v18.3,9.95 19.21,9.95 19.21,9.96 20.05,9.96 20.3,9.7 | 20.3,9.7 v21.09,8.91 v21.09,8.9 | v21.1,16.6 21.2,16.7 21.2,18.7 20.9,19 19.8,19 19.5,18.7 v19.5,18.4
IMU_SDA  (via drill 0.3 pad 0.2)
  Top 0.203: IC1.24 15,7.52 v15.26,7.25 16.32,8.31 16.32,8.93 17,9.61 17,12.14 19.59,14.73 19.59,16.99 18.77,17.81 v18.77,18.61 19.06,18.9 20.7,18.9 U$17.P$8
  Bottom 0.203: Q2.2 18.1,2.3 18.6,2.8 R1.3 18.8,4.3 18.66,4.44 17.44,4.44 17.12,4.77 17.12,6.05 16.04,7.13 15.39,7.13 v15.26,7.25
IMU_SDO  (via drill 0.3 pad 0.2)
  Top 0.203: v14.3,12 14.2,11.9 IC1.9 | v19.55,17.75 20.75,17.75 U$17.P$10 | v16.4,17.4 15.6,17.4 13.8,15.6 v13.8,15.4
  Bottom 0.203: R2.3 18.6,8.47 18.13,8 Q5.2 17.45,8.14 16.81,8.14 15.9,9.06 15.9,11.1 15,12 v14.3,12 14.3,14.9 v13.8,15.4 | v19.55,17.75 19.2,17.4 v16.4,17.4
MISO  (via drill 0.3 pad 0.2)
  Top 0.203: v18.9,8.1 18.4,8.6 v17.1,8.6 | U1.28 17.58,17.76 18.29,17.76 19.25,16.79 19.25,14.91 18.6,14.26 | 18.6,14.26 17.14,12.8 v16.84,12.8 | 18.6,14.26
  Bottom 0.203: Q5.3 18.75,7.95 v18.9,8.1 | v16.84,12.8 16.5,12.46 16.21,12.46 15.94,12.19 15.94,11.82 17.1,10.66 17.1,9.1 | v17.1,8.6 17.1,9.1 | R2.4 17.65,9.1 17.1,9.1
MOSI  (via drill 0.3 pad 0.2)
  Top 0.203: v13.45,6.95 13.35,6.95 12.76,6.37 11.38,6.37 10.64,7.1 10.64,7.49 10.9,7.74 10.9,9.81 13.58,12.49 v14.8,12.49 | v18.8,16.6 18.31,17.09 U1.27 | v16.4,16.5 15.3,15.4 v15.1,15.4
  Bottom 0.203: Q2.3 16.53,1.8 16.36,1.98 16.36,2.7 16.61,2.95 17.6,2.95 17.7,3.05 R1.4 17.3,3.75 16.79,4.26 16.79,5.91 15.9,6.8 14.74,6.8 14.4,7.14 13.63,7.14 v13.45,6.95 | v16.4,16.5 16.5,16.6 v18.8,16.6 | v15.1,15.4 14.8,15.1 v14.8,12.49
N$1
  Top 0.305: C2.1 6.54,12.96 7.06,12.44 7.82,12.44 X4.P$1 9.04,12.14 9.45,12.55 U1.13
N$2
  Top 0.203: X4.P$2 10.15,12.51 U1.14
  Top 0.305: X4.P$2 10.52,10.92 10.3,10.7 7.1,10.7 6.84,10.96 C4.1
N$3
  Top 0.305: L2.2 7.15,17.1 U1.10
N$4
  Bottom 0.203: CHG.C 1.6,12.05 R5.2
N$6  (via drill 0.3 pad 0.2)
  Top 0.305: v3.4,21.2 3.4,23.3 S2.1
  Bottom 0.305: U$23.P$1 2.77,21.2 v3.4,21.2
N$7  (via drill 0.3 pad 0.2)
  Top 0.203: v13.6,11.7 13.6,11.5 13.8,11.3 IC1.10
  Bottom 0.203: C18.1 13.7,11.6 v13.6,11.7
N$8
  Top 0.203: L2.1 6,21.72
  Top 0.305: 6,21.72 C1.1 | U1.9 7.31,17.79 7.05,18.05 7.05,19 6.88,19.18 6.22,19.18 6,19.4 L2.1
N$9
  Bottom 0.203: R5.1 3.45,12.92 2.76,13.61 2.76,15.4 3.04,15.68 U3.1
N$10
  Bottom 0.305: U3.5 0.6,16.27 0.6,16.7 0.9,17 R6.2
N$11
  Bottom 0.203: R8.2 10.7,11.7 9.9,10.9 9.9,10.51 9.4,10.01 U4.21
N$14
  Bottom 0.203: U4.16 6.91,12.31 7,12.4 9.4,12.4 9.64,12.64 C8.1
RESET  (via drill 0.3 pad 0.2)
  Top 0.203: C11.1 5.6,8 | 5.6,8 4.2,8 3.97,8.23 D4.A 3.1,9 2.4,9.7 2.1,9.7 1.85,9.95 R7.2 1.85,11.25 2.1,11.5 3.3,11.5 3.5,11.7 3.5,12.2 SW1.A | TP2.P$1 5.7,8.1 5.6,8
  Top 0.305: SW1.A SW1.A' 3.46,17.96 v3.7,18.2 | v16.1,22.7 U1.35
  Bottom 0.203: v3.7,18.2 8.2,22.7 v16.1,22.7
RXD  (via drill 0.3 pad 0.2)
  Top 0.203: v13.8,13 14.6,13 15.05,13.45 U1.21
  Bottom 0.203: R8.1 12.65,13 v13.8,13
SCK  (via drill 0.3 pad 0.2)
  Top 0.203: v18.8,15.4 18.8,15.9 18.31,16.39 U1.26 | v20.3,13 20.3,10.8 19.4,9.9 v19.4,9.5
  Bottom 0.203: Q4.3 19.4,7.75 R2.2 v19.4,9.5 | v18.8,15.4 18.8,13.8 19.6,13 v20.3,13
TXD  (via drill 0.3 pad 0.2)
  Top 0.203: v11.42,12.65 12.75,12.65 13.65,13.55 U1.19
  Bottom 0.203: U4.20 9.33,10.51 9.57,10.75 9.57,11.69 10.53,12.65 v11.42,12.65
USBD+  (via drill 0.3 pad 0.2)
  Top 0.203: v10.6,6.5 10.6,5.42 X3.D+
  Bottom 0.203: U4.3 6.91,7.3 7.11,7.1 10.4,7.1 10.6,6.9 v10.6,6.5
USBD-  (via drill 0.3 pad 0.2)
  Top 0.203: X3.D- 9.98,6.48 v10,6.5
  Bottom 0.203: U4.4 6.41,7.21 6.4,7.2 6.83,6.77 9.73,6.77 v10,6.5
VBAT  (via drill 0.3 pad 0.2)
  Top 0.305: v3.46,7.7 Q3.3 | S2.2 4.8,23.4 v4.8,17.7
  Bottom 0.305: v3.46,7.7 3.47,7.71 3.47,9.08 3.98,9.59 3.98,11.29 4.23,11.53 4.23,12.87 3.79,13.3 U3.3 4.48,13.78 5.6,14.9 5.6,15.46 C7.1 5.74,15.4 6.4,15.4 6.7,15.7 6.7,17 6,17.7 v4.8,17.7
VBUS  (via drill 0.3 pad 0.2)
  Top 0.305: X3.VBUS 9.33,6.27 9.08,6.52 5.82,6.52 5.43,6.91 v5.1,6.91 | v1,5.6 1.1,5.7 Q3.1
  Bottom 0.305: R3.2 1.7,2.55 D5.A 3.2,4 | v5.1,6.91 4.93,7.08 4.91,7.08 4.34,7.64 | 4.34,7.64 3.9,8.09 3.9,8.9 4.01,9.01 U4.8 | 3.2,4 2.8,4.4 2.19,4.4 v1,5.59 v1,5.6 1,6.68 1.6,7.29 CHG.A 0.72,9.43 0.72,12.62 1.19,13.09 U3.4 | 3.2,4 4.34,5.14 4.34,7.64
VIN  (via drill 0.3 pad 0.2)
  Top 0.305: v4.8,1 4.8,2.4 4.55,2.65 U2.1 | C5.1 2.22,1.62 2.7,2.1 3.8,2.1 3.9,2.2 U2.1 | U2.1 3.25,2.65 2.9,3 2.9,4.95 Q3.2 3.2,6.15 D5.C
  Bottom 0.305: R4.2 4.9,1.1 v4.8,1
  other vias: 3.2,6.25